# Altium schematic sheet Expansion_Board.SchDoc
size A4; SheetNumber: 1; SheetTotal: 2
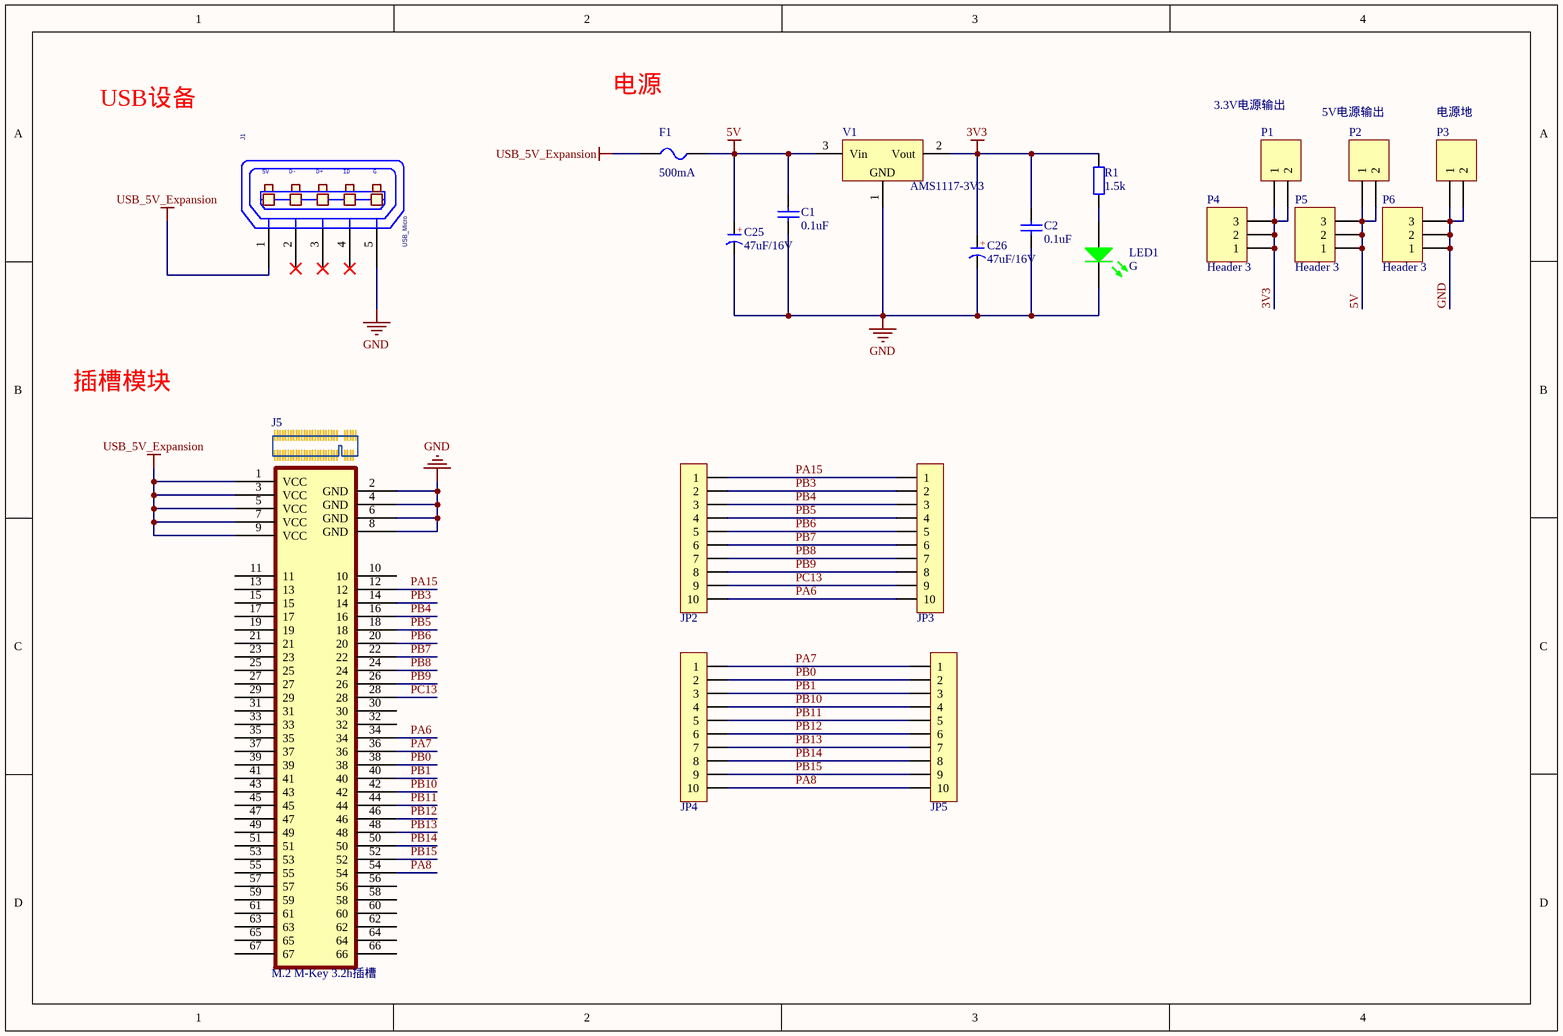
[diagram p0: Expansion_Board.SchDoc]

## Parts
C1  0.1uF  [0805_C]
C2  0.1uF  [0805_C]
C25  47uF/16V  [CM C(5*5.4)]
C26  47uF/16V  [CM C(5*5.4)]
F1  500mA  [FU 1210]
J1  USB_Micro  [USB-MICRO]
J5  M.2 M-Key 3.2h插槽  [M-Key Socket]
JP2  HDR-1X10  [HDR2.54-LI-10P]  (value not drawn)
JP3  HDR-1X10  [HDR2.54-M-LI-10P]  (value not drawn)
JP4  HDR-1X10  [HDR2.54-LI-10P]  (value not drawn)
JP5  HDR-1X10  [HDR2.54-M-LI-10P]  (value not drawn)
LED1  G  [LED 0805G]
P1  3.3V电源输出  [KF128-5.08-2P]
P2  5V电源输出  [KF128-5.08-2P]
P3  电源地  [KF128-5.08-2P]
P4  Header 3  [HDR-1X3_M]
P5  Header 3  [HDR-1X3_M]
P6  Header 3  [HDR-1X3_M]
R1  1.5k  [0805_R]
V1  AMS1117-3V3  [SOT223]

## Nets
3V3: C2.2 C26.1(A) P1.1 P1.2 P4.1 P4.2 P4.3 R1.2 V1.2(Vout)
5V: C1.2 C25.1(A) F1.2 P2.1 P2.2 P5.1 P5.2 P5.3 V1.3(Vin)
GND: C1.1 C2.1 C25.2(K) C26.2(K) J1.5(P5) J5.2(GND) J5.4(GND) J5.6(GND) J5.8(GND) LED1.2(K) P3.1 P3.2 P6.1 P6.2 P6.3 V1.1(GND)
USB_5V_Expansion: F1.1 J1.1(P1) J5.1(VCC) J5.3(VCC) J5.5(VCC) J5.7(VCC) J5.9(VCC)
PA6: J5.34 JP2.10 JP3.10
PA7: J5.36 JP4.1 JP5.1
PA8: J5.54 JP4.10 JP5.10
PA15: J5.12 JP2.1 JP3.1
PB0: J5.38 JP4.2 JP5.2
PB1: J5.40 JP4.3 JP5.3
PB3: J5.14 JP2.2 JP3.2
PB4: J5.16 JP2.3 JP3.3
PB5: J5.18 JP2.4 JP3.4
PB6: J5.20 JP2.5 JP3.5
PB7: J5.22 JP2.6 JP3.6
PB8: J5.24 JP2.7 JP3.7
PB9: J5.26 JP2.8 JP3.8
PB10: J5.42 JP4.4 JP5.4
PB11: J5.44 JP4.5 JP5.5
PB12: J5.46 JP4.6 JP5.6
PB13: J5.48 JP4.7 JP5.7
PB14: J5.50 JP4.8 JP5.8
PB15: J5.52 JP4.9 JP5.9
PC13: J5.28 JP2.9 JP3.9
NetLED1_1: LED1.1(A) R1.1

Not connected (* = marked no-connect by the designer): J1 2(P2)* 3(P3)* 4(P4)*; J5 10 11 13 15 17 19 21 23 25 27 29 30 31 32 33 35 37 39 41 43 45 47 49 51 53 55 56 57 58 59 60 61 62 63 64 65 66 67

## Notes on the sheet
- USB设备
- 电源
- 插槽模块
- 工程名：
- 设计者：江瀚林&Jarvis
- 日期：
- 班级：
- 文档路径：
- (in symbol Cap_ELE) +
- (in symbol USB_Micro) 5V; D-; D+; ID; G

## Library data of the parts
C1 C2 = Cap_SMD: 0805贴片电容; Value: 100nF; Voltage: 63V; Published: 8-Jun-2000; Revision: July-2002: Re-released for DXP Platform.; Publisher: Altium Limited; 实物样品照片: https://item.taobao.com/item.htm?spm=a230r.1.14.32.21fd24b7VWml4d&id=37914290992&ns=1&abbucket=13#detail
C25 C26 = Cap_ELE: 电解电容
F1 = FU: 贴片保险丝; 版权归属: 源创客; BOM名称: 贴片保险丝; 学习资源: www.ooocke.com
J1 = USB_Micro: CLASS: IO; AGILE_PN: 211-80104; MFG_NAME01: ANYTRONIC CORPORATION LIMITED; MFG_PN01: 23970101#LCP-58LF; Temp_Range: -55&#8451; to 105&#8451;; CAD_APPROVED: Yes; ROHS: Yes; HEIGHT: 2.8MM
J5 = M-Key Socket
JP2-JP5 = Header 10: 10P接插件; 版权归属: 源创客; BOM名称: 10P接插件; 学习资源: www.ooocke.com
LED1 = LED_G: 绿色LED; Published: 8-Jun-2000; Revision: July-2002: Re-released for DXP Platform.; Publisher: Altium Limited
P1-P3 = Header 2: 2P接插件; LatestRevisionDate: 17-Jul-2002; LatestRevisionNote: Re-released for DXP Platform.; Publisher: Altium Limited
P4-P6 = Header 3: 3P接插件; LatestRevisionDate: 17-Jul-2002; LatestRevisionNote: Re-released for DXP Platform.; Publisher: Altium Limited
R1 = Res_SMD: 0805贴片电阻; Value: 1K; Published: 8-Jun-2000; LatestRevisionDate: 17-Jul-2002; LatestRevisionNote: Re-released for DXP Platform.; PackageReference: AXIAL-0.4; Publisher: Altium Limited; PackageDescription: Axial Device, Thru-Hole; 2 Leads; 0.4 in Pin Spacing
V1 = AMS1117: 三端稳压芯片; BOM名称: 稳压芯片; 版权归属: 源创客; 学习资源: www.ooocke.com